# EAGLE design cpNode_V3_4 (EAGLE 7.7.0)
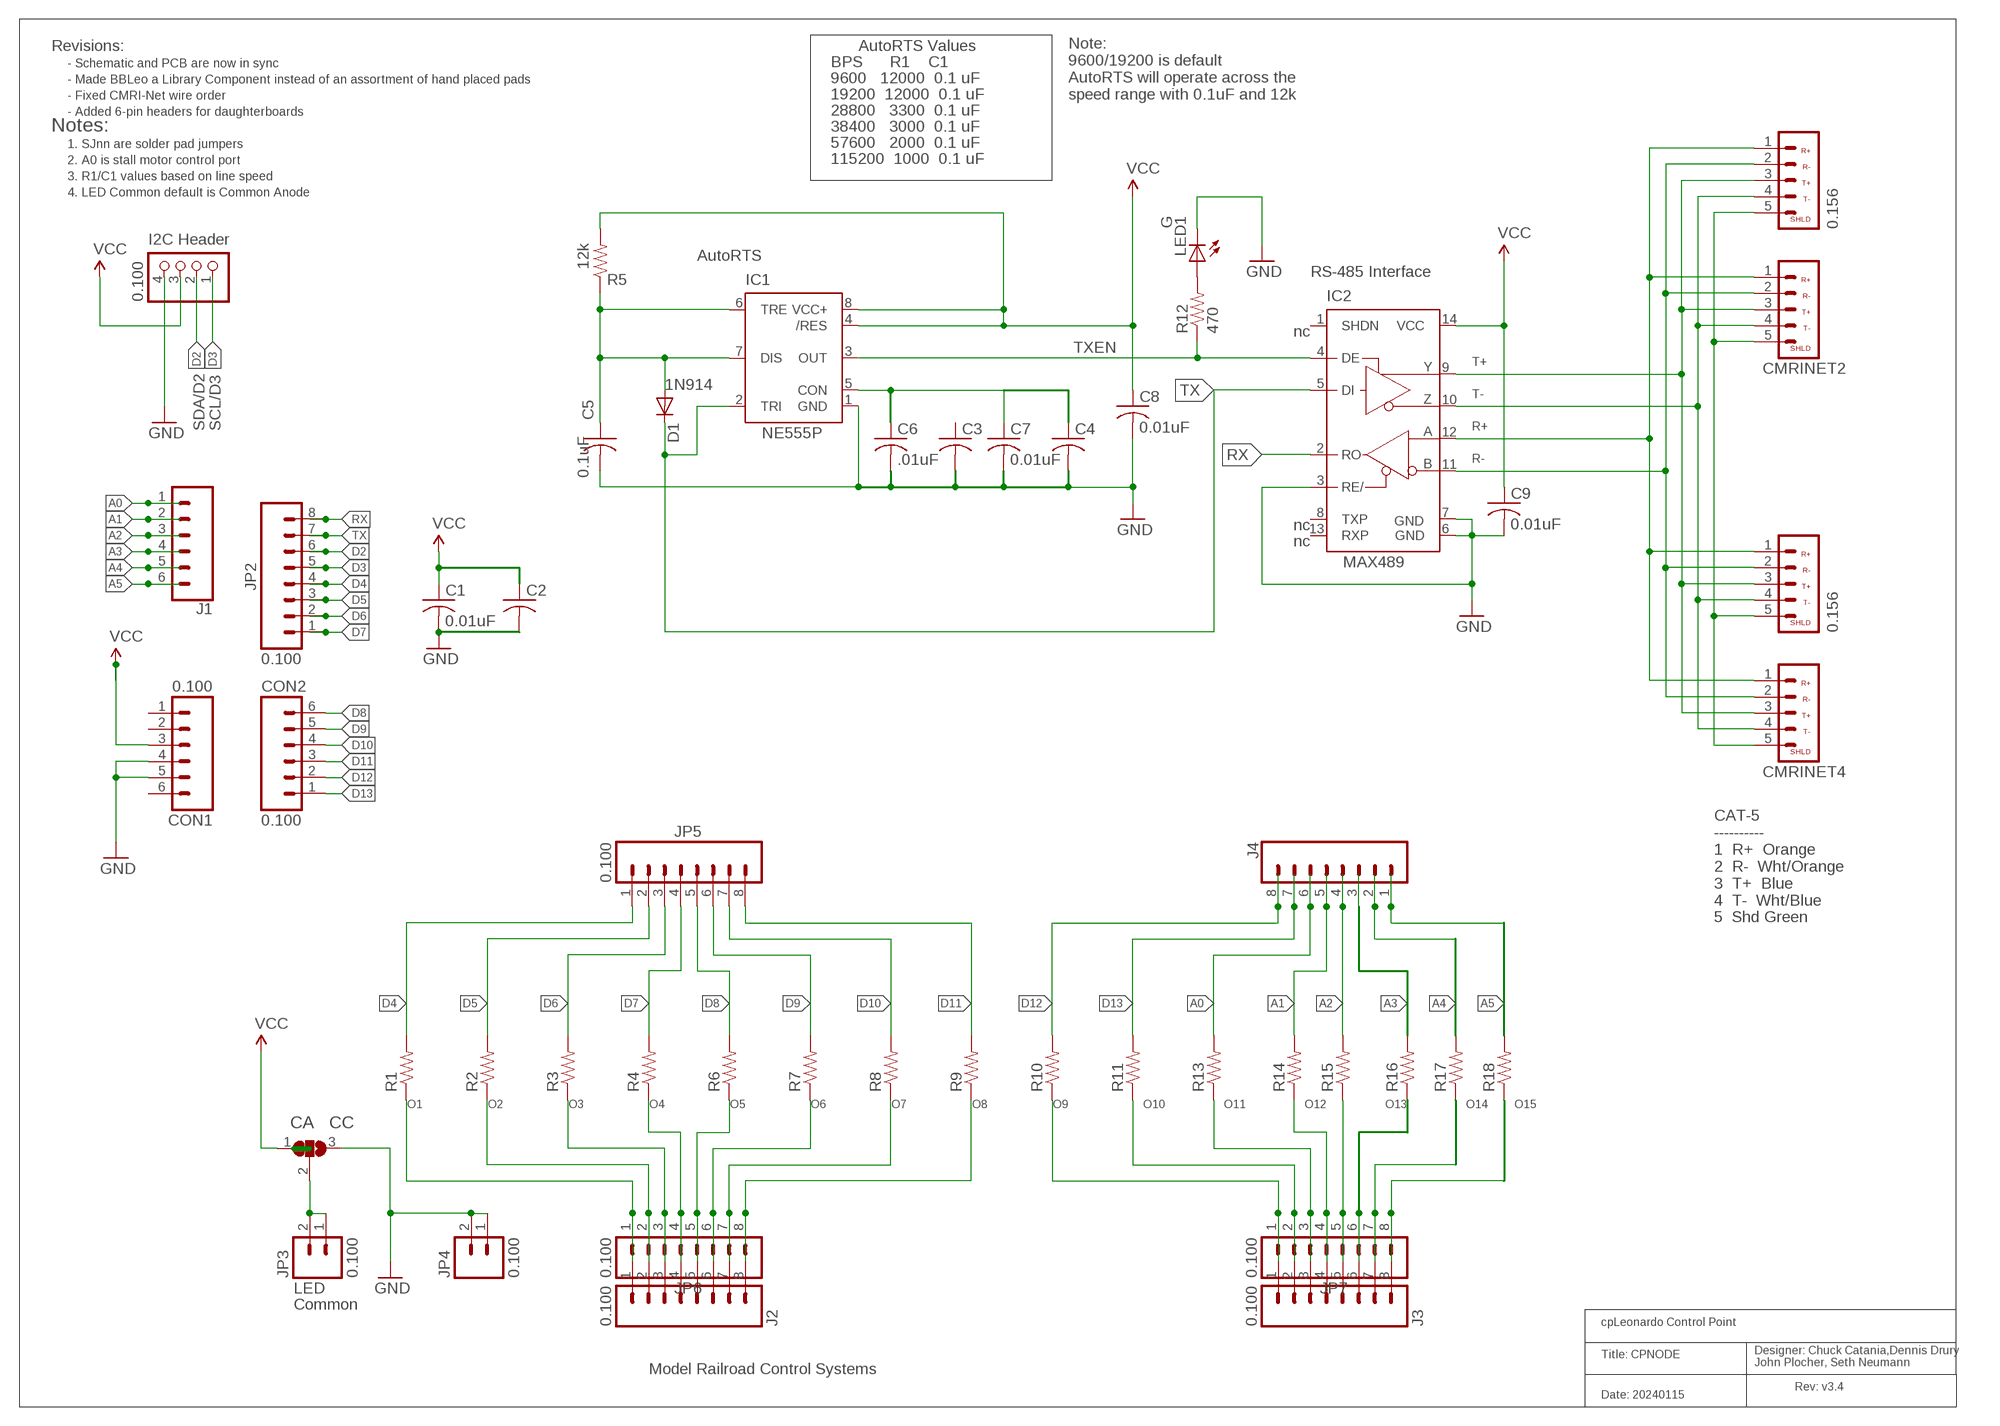
[diagram p0: schematic, sheet 1]

## Parts
C1  0.01uF  CAPPTH2  [C-PTH-0.100]
C2  CAPPTH1  [C050-024X044]
C3  CAPPTH1  [C050-024X044]
C4  CAPPTH1  [C050-024X044]
C5  0.1uF  CAPPTH2  [C-PTH-0.100]
C6  .01uF  CAPPTH1  [C050-024X044]
C7  0.01uF  CAPPTH2  [C-PTH-0.100]
C8  0.01uF  CAPPTH2  [C-PTH-0.100]
C9  0.01uF  CAPPTH2  [C-PTH-0.100]
CMRINET1  0.156  CONNECTOR-CMRINET.156  [KK-156-5]
CMRINET2  3.5mm  CONNECTOR-CMRINET3.5MM  [CMRINET-3.5MM]
CMRINET3  0.156  CONNECTOR-CMRINET.156  [KK-156-5]
CMRINET4  3.5mm  CONNECTOR-CMRINET3.5MM  [CMRINET-3.5MM]
CON1  0.100  CONNECTOR-M06SIP_LOCK  [1X06-SIP_LOCK]
CON2  0.100  CONNECTOR-M06SIP_LOCK  [1X06-SIP_LOCK]
D1  1N4148  DIODE1N4148  [DIODE-1N4148]
IC1  NE555P  [DIL-08]
IC2  MAX3465CPD  [DIL14]
J1  CONN_06SILK_FEMALE_PTH  [1X06]
J2  0.100  CONNECTOR-M08LOCK_LONGPADS  [1X08_LOCK_LONGPADS]
J3  0.100  CONNECTOR-M08LOCK_LONGPADS  [1X08_LOCK_LONGPADS]
J4  CONN_08"  [1X08]
JP1  0.100  PINHD-1X4/90  [1X04/90]
JP2  0.100  M081X08  [1X08]
JP3  0.100  M02POLAR_LOCK  [MOLEX-1X2_LOCK]
JP4  0.100  M02POLAR_LOCK  [MOLEX-1X2_LOCK]
JP5  0.100  M081X08  [1X08]
JP6  0.100  M081X08  [1X08]
JP7  0.100  M081X08  [1X08]
LED1  G  LEDLED3MM  [LED3MM]
P1  CA CC  PAD-SOLDERJUMPER-2WAYT  [3P-SMD-2X4.8]
R1  RPTH-R0  [CUT-R]
R2  RPTH-R0  [CUT-R]
R3  RPTH-R0  [CUT-R]
R4  RPTH-R0  [CUT-R]
R5  12k  RPTH04  [AXIAL-0.4-RES]
R6  RPTH-R0  [CUT-R]
R7  RPTH-R0  [CUT-R]
R8  RPTH-R0  [CUT-R]
R9  RPTH-R0  [CUT-R]
R10  RPTH-R0  [CUT-R]
R11  RPTH-R0  [CUT-R]
R12  470  RPTH04  [AXIAL-0.4-RES]
R13  RPTH-R0  [CUT-R]
R14  RPTH-R0  [CUT-R]
R15  RPTH-R0  [CUT-R]
R16  RPTH-R0  [CUT-R]
R17  RPTH-R0  [CUT-R]
R18  RPTH-R0  [CUT-R]

## Nets
A0: J1.1 J4.6 R13.P1
A1: J1.2 J4.5 R14.P1
A2: J1.3 J4.4 R15.P1
A3: J1.4 J4.3 R16.P1
A4: J1.5 J4.2 R17.P1
A5: J1.6 J4.1 R18.P1
D2: JP1.2 JP2.6
D3: JP1.1 JP2.5
D4: JP2.4 JP5.1 R1.P1
D5: JP2.3 JP5.2 R2.P1
D6: JP2.2 JP5.3 R3.P1
D7: JP2.1 JP5.4 R4.P1
D8: CON2.6 JP5.5 R6.P1
D9: CON2.5 JP5.6 R7.P1
D10: CON2.4 JP5.7 R8.P1
D11: CON2.3 JP5.8 R9.P1
D12: CON2.2 J4.8 R10.P1
D13: CON2.1 J4.7 R11.P1
GND: C1.2 C2.2 C3.2 C4.2 C5.2 C6.2 C7.2 C8.2 C9.2 CON1.4 CON1.5 IC1.1(GND) IC2.3(RE/) IC2.6(GND) IC2.7(GND) JP1.4 JP4.1 JP4.2 LED1.K(C) P1.3
N$29: LED1.A R12.P$2
N$38: C4.1 C6.1 C7.1 IC1.5(CON)
N$45: JP3.1 JP3.2 P1.2
N$52: C5.1 D1.A IC1.6(TRE) IC1.7(DIS) R5.P$1
N$54: IC1.3(OUT) IC2.4(DE) R12.P$1
O1: J2.1 JP6.1 R1.P2
O2: J2.2 JP6.2 R2.P2
O3: J2.3 JP6.3 R3.P2
O4: J2.4 JP6.4 R4.P2
O5: J2.5 JP6.5 R6.P2
O6: J2.6 JP6.6 R7.P2
O7: J2.7 JP6.7 R8.P2
O8: J2.8 JP6.8 R9.P2
O9: J3.1 JP7.1 R10.P2
O10: J3.2 JP7.2 R11.P2
O11: J3.3 JP7.3 R13.P2
O12: J3.4 JP7.4 R14.P2
O13: J3.5 JP7.5 R15.P2
O14: J3.6 JP7.6 R16.P2
O15: J3.7 JP7.7 R17.P2
O16: J3.8 JP7.8 R18.P2
R+: CMRINET1.1 CMRINET2.1 CMRINET3.1 CMRINET4.1 IC2.12(A)
R-: CMRINET1.2 CMRINET2.2 CMRINET3.2 CMRINET4.2 IC2.11(B)
RX: IC2.2(RO) JP2.8
SHIELD: CMRINET1.5 CMRINET2.5 CMRINET3.5 CMRINET4.5
T+: CMRINET1.3 CMRINET2.3 CMRINET3.3 CMRINET4.3 IC2.9(Y)
T-: CMRINET1.4 CMRINET2.4 CMRINET3.4 CMRINET4.4 IC2.10(Z)
TX: D1.C IC1.2(TRI) IC2.5(DI) JP2.7
VCC: C1.1 C2.1 C8.1 C9.1 CON1.3 IC1.4(/RES) IC1.8(VCC+) IC2.14(VCC) JP1.3 P1.1 R5.P$2
Unconnected: C3.1 CON1.1 CON1.2 CON1.6 IC2.1(SHDN) IC2.8(TXP) IC2.13(RXP)

## Notes on the sheet
- Revisions: | AutoRTS Values
- - Schematic and PCB are now in sync | BPS      R1    C1
- - Made BBLeo a Library Component instead of an assortment of hand placed pads | 9600   12000  0.1 uF
- - Fixed CMRI-Net wire order | 19200  12000  0.1 uF
- Note: 
  9600/19200 is default
  AutoRTS will operate across the
  speed range with 0.1uF and 12k
- - Added 6-pin headers for daughterboards | 28800   3300  0.1 uF
- Notes: | 38400   3000  0.1 uF
- 1. SJnn are solder pad jumpers | 57600   2000  0.1 uF
- 2. A0 is stall motor control port | 115200  1000  0.1 uF
- 3. R1/C1 values based on line speed
- 4. LED Common default is Common Anode
- I2C Header
- AutoRTS
- RS-485 Interface
- nc
- TXEN
- T+
- 1N914
- T-
- SDA/D2 | SCL/D3 | R+
- R-
- nc
- nc
- MAX489
- CAT-5
  ----------
  1  R+  Orange
  2  R-  Wht/Orange
  3  T+  Blue
  4  T-  Wht/Blue
  5  Shd Green
- LED
- Common
- cpLeonardo Control Point
- Title: CPNODE
- Designer: Chuck Catania,Dennis Drury
  John Plocher, Seth Neumann
- Model Railroad Control Systems
- Rev: v3.4
- Date: 20240115

## Library data of the parts
C1-C9 = SPCoast:CAP*
CMRINET1-CMRINET4 = SPCoast:CONNECTOR-CMRINET: CMRINet Top 3.5mm Screw Terminal 5 pos
CON1 CON2 = SPCoast:CONNECTOR-M06: Header 6 Standard 6-pin 0.1" header
D1 = SPCoast:DIODE: Diode These are standard reverse protection diodes and small signal diodes. SMA package can handle up to about 1A. SOD-323 can handle about 200mA. What the SOD-323 package when ordering, there are some mfgs out there that are 5-pin packages.
IC1 = SparkFun:NE555: General purpose bipolar Timer; MF: Arrow Electronics; MPN: NE555N; OC_FARNELL: 1467742; OC_NEWARK: 89K1486
IC2 = maxim:MAX346*: +5V, Fail-Safe, 40Mbps, Profibus RS-485/RS-422 Transceivers Source: MAX3465-MAX3469.pdf; MPN: MAX3465CPD+; OC_FARNELL: unknown; OC_NEWARK: 42M5444
J1 = SparkFun-Connectors:CONN_06: Multi connection point. Often used as Generic Header-pin footprint for 0.1 inch spaced/style header connections On any of the 0.1 inch spaced packages, you can populate with these: Break Away Headers - Straight <https://www.sparkfun.com/products/116> (PRT-00116) Break Away Male Headers - Right Angle <https://www.sparkfun.com/products/553> (PRT-00553) Female Headers <https://www.sparkfun.com/products/115> (PRT-00115) Break Away Headers - Machine Pin <https://www.sparkfun.com/products/117> (PRT-00117) Break Away Female Headers - Swiss Machine Pin <https://www.sparkfun.com/products/743> (PRT-00743) Arduino Stackable Header - 6 Pin <https://www.sparkfun.com/products/9280> (PRT-09280) For SCREWTERMINALS and SPRING TERMINALS visit here: Screw Terimnals on SparkFun.com <https://www.sparkfun.com/search/results?term=Screw+Terminals> (5mm/3.5mm/2.54mm spacing) This device is also useful as a general connection point to wire up your design to another part of your project. Our various solder wires solder well into these plated through hole pads. Hook-Up Wire - Assortment (Stranded, 22 AWG) <https://www.sparkfun.com/products/11375> (PRT-11375) Hook-Up Wire - Assortment (Solid Core, 22 AWG) <https://www.sparkfun.com/products/11367> (PRT-11367) View the entire wire category on our website here <https://www.sparkfun.com/categories/141>; PROD_ID: CONN-08437
J2 J3 = SPCoast:CONNECTOR-M08: Header 8 Standard 8-pin 0.1" header. Use with straight break away headers (SKU : PRT-00116), right angle break away headers (PRT-00553), swiss pins (PRT-00743), machine pins (PRT-00117), and female headers (PRT-00115).
J4 = SparkFun-Connectors:CONN_08: Multi connection point. Often used as Generic Header-pin footprint for 0.1 inch spaced/style header connections On any of the 0.1 inch spaced packages, you can populate with these: Break Away Headers - Straight <https://www.sparkfun.com/products/116> (PRT-00116) Break Away Male Headers - Right Angle <https://www.sparkfun.com/products/553> (PRT-00553) Female Headers <https://www.sparkfun.com/products/115> (PRT-00115) Break Away Headers - Machine Pin <https://www.sparkfun.com/products/117> (PRT-00117) Break Away Female Headers - Swiss Machine Pin <https://www.sparkfun.com/products/743> (PRT-00743) Arduino Stackable Header - 8 Pin <https://www.sparkfun.com/products/9279> (PRT-09279) For SCREWTERMINALS and SPRING TERMINALS visit here: Screw Terimnals on SparkFun.com <https://www.sparkfun.com/search/results?term=Screw+Terminals> (5mm/3.5mm/2.54mm spacing) This device is also useful as a general connection point to wire up your design to another part of your project. Our various solder wires solder well into these plated through hole pads. Hook-Up Wire - Assortment (Stranded, 22 AWG) <https://www.sparkfun.com/products/11375> (PRT-11375) Hook-Up Wire - Assortment (Solid Core, 22 AWG) <https://www.sparkfun.com/products/11367> (PRT-11367) View the entire wire category on our website here <https://www.sparkfun.com/categories/141> Special notes: Molex polarized connector foot print use with SKU : PRT-08231 with associated crimp pins and housings. 1MM SMD Version SKU: PRT-10208 NOTES ON THE VARIANTS LOCK and LOCK_LONGPADS... This footprint was designed to help hold the alignment of a through-hole component (i.e. 6-pin header) while soldering it into place. You may notice that each hole has been shifted either up or down by 0.005 of an inch from it's more standard position (which is a perfectly straight line). This slight alteration caused the pins (the squares in the middle) to touch the edges of the holes. Because they are alternating, it causes a "brace" to hold the component in place. 0.005 has proven to be the perfect amount of "off-center" position when using our standard breakaway headers. Although looks a little odd when you look at the bare footprint, once you have a header in there, the alteration is very hard to notice. Also,if you push a header all the way into place, it is covered up entirely on the bottom side.; PROD_ID: CONN-08438
JP1 = pinhead:PINHD-1X4: PIN HEADER
JP2 JP5-JP7 = SparkFun:M08: Header 8 Standard 8-pin 0.1" header. Use with straight break away headers (SKU : PRT-00116), right angle break away headers (PRT-00553), swiss pins (PRT-00743), machine pins (PRT-00117), and female headers (PRT-00115).
JP3 JP4 = SparkFun:M02: Header 2 Standard 2-pin 0.1" header. Use with straight break away headers (SKU : PRT-00116), right angle break away headers (PRT-00553), swiss pins (PRT-00743), machine pins (PRT-00117), and female headers (PRT-00115). Molex polarized connector foot print use with SKU : PRT-08233 with associated crimp pins and housings.
LED1 = SPCoast:LED*
P1 = Discreter:PAD-SOLDERJUMPER-2WAY: Solder Jumper 2 way solder jumper
R1-R18 = SPCoast:R*: Resistor Basic schematic elements and footprints for 0603, 1206, and PTH 1/10th watt (small) resistors.

## Board
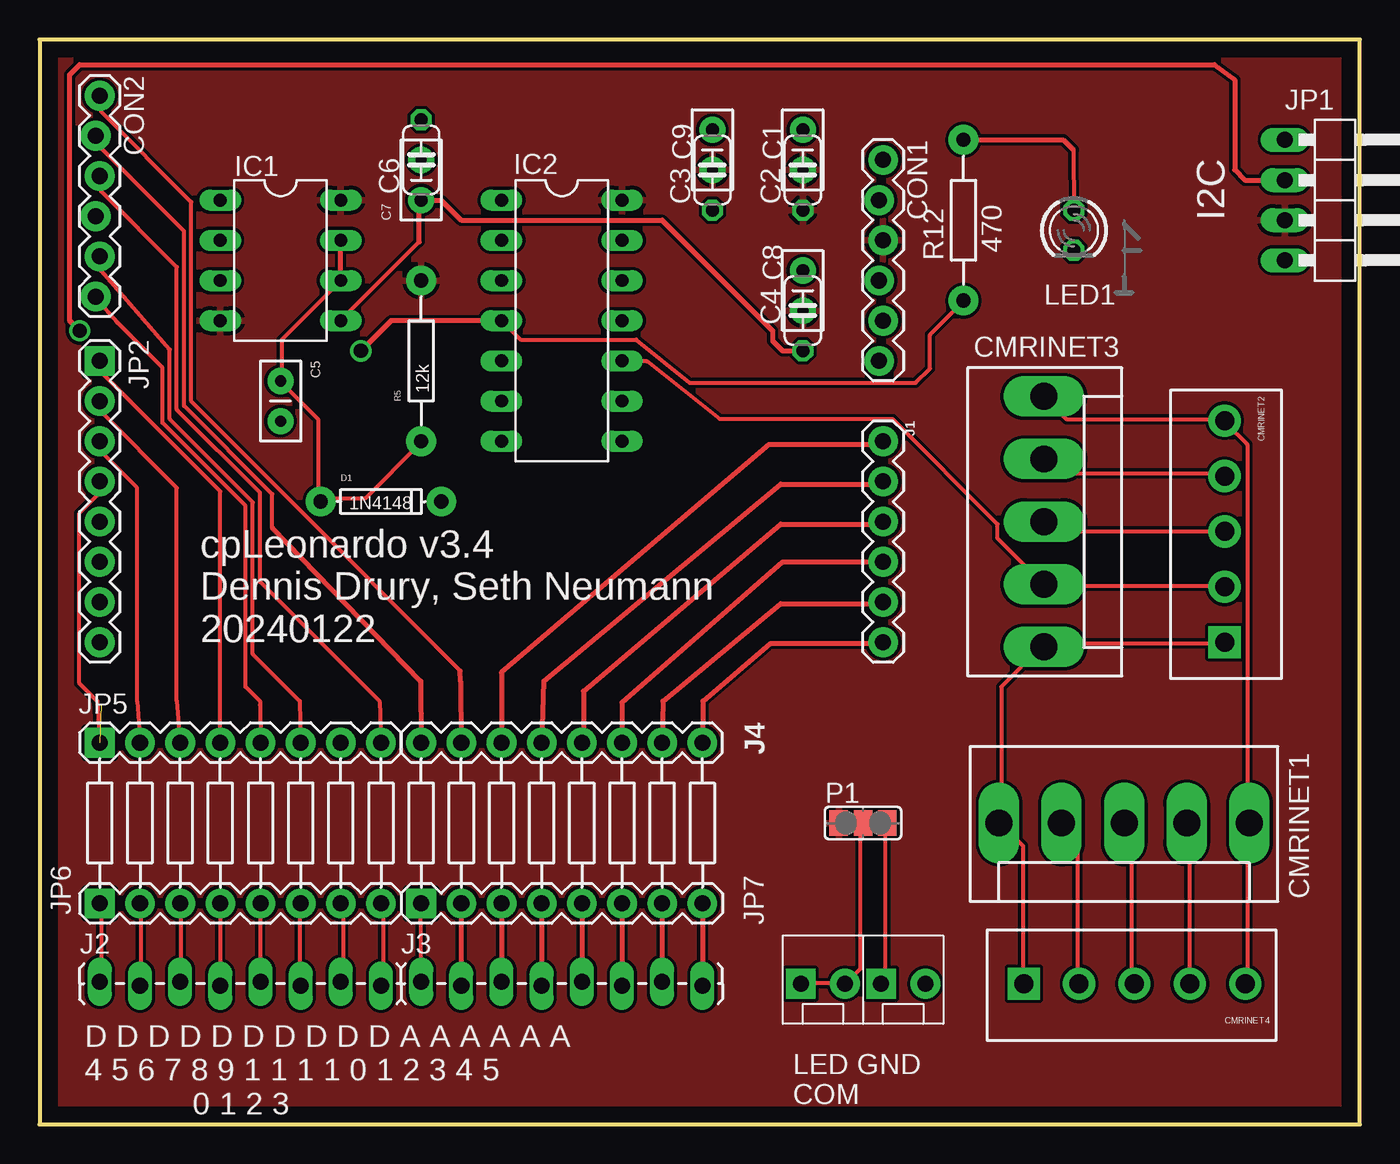
[diagram p1: board, top side]
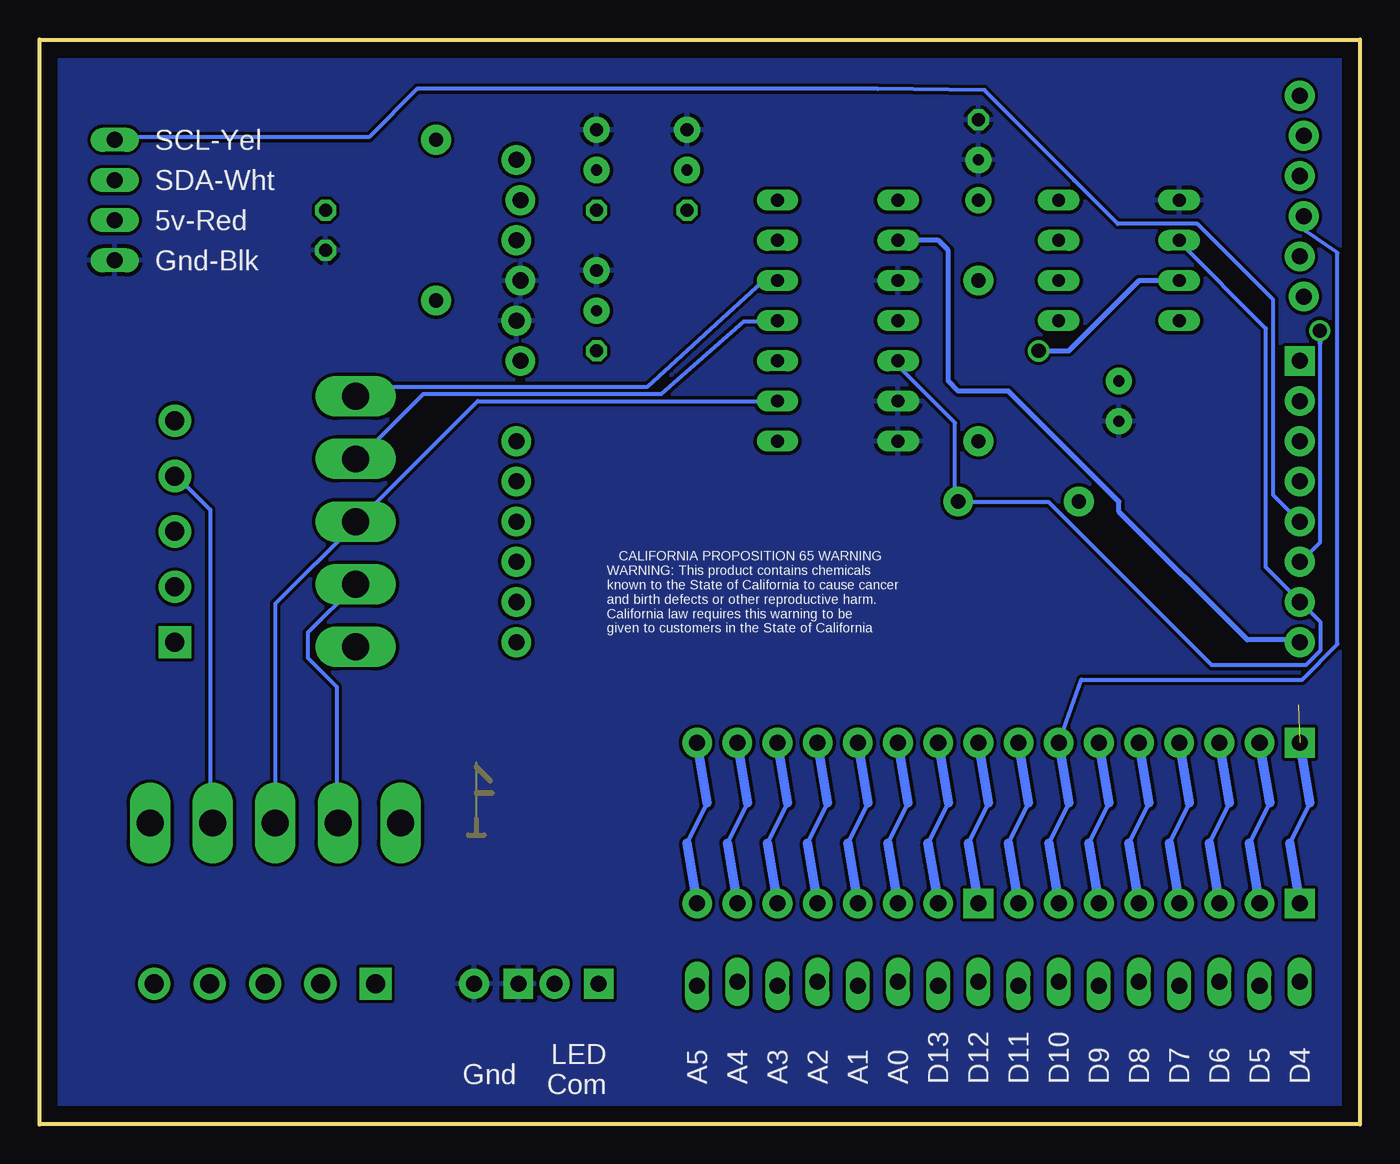
[diagram p2: board, bottom side, seen from below]

Size 83.49 x 68.57 mm. Coordinates in mm from the lower left corner, seen from the top.
Outline: 0,0 83.49,0 83.49,68.57 0,68.57 0,0
Copper layers (1*16): Top 0.035mm / dielectric 1.5mm / Bottom 0.035mm
Design rules "default": minimum track width 10mil, minimum drill 24mil, track to track 8mil, track to pad 8mil, pad to pad 8mil, via to via 8mil, smd to smd 8mil, copper to edge 40mil, drill to drill 8mil, minimum pad ring 10mil, minimum via ring 8mil, stop-mask expansion 4mil, vias tented up to drill 0mil, thermal gap 10mil

### Footprints (pad centres in the part's own frame; a part is rotated, then mirrored left to right if it is on the bottom)
C-PTH-0.100 = drill 0.7 pad 1.651: 1 -1.27,0; 2 1.27,0
C050-024X044 = drill 0.813 octagon: 1 -2.54,0; 2 2.54,0
KK-156-5 = drill 1.7 pad 2.184 long: 1 -7.92,0; 2 -3.96,0; 3 0,0; 4 3.96,0; 5 7.92,0
CMRINET-3.5MM = drill 1.2 pad 2.032: 1 -6.38,0; 2 -2.88,0; 3 0.62,0; 4 4.12,0 | drill 1.2 pad 2.032 square: 5 7.62,0
1X06-SIP_LOCK = drill 1.016 pad 1.88: 1 0,0; 2 2.54,-0.254; 3 5.08,0; 4 7.62,-0.254; 5 10.16,0; 6 12.7,-0.254
DIODE-1N4148 = drill 0.9 pad 1.88: A 3.81,0; C -3.81,0
DIL-08 = drill 0.813 long: 1 -3.81,-3.81; 2 -1.27,-3.81; 3 1.27,-3.81; 4 3.81,-3.81; 5 3.81,3.81; 6 1.27,3.81; 7 -1.27,3.81; 8 -3.81,3.81
DIL14 = drill 0.813 long: 1 -7.62,-3.81; 2 -5.08,-3.81; 3 -2.54,-3.81; 4 0,-3.81; 5 2.54,-3.81; 6 5.08,-3.81; 7 7.62,-3.81; 8 7.62,3.81; 9 5.08,3.81; 10 2.54,3.81; 11 0,3.81; 12 -2.54,3.81; 13 -5.08,3.81; 14 -7.62,3.81
1X06 = drill 1.016 pad 1.88: 1 0,0; 2 2.54,0; 3 5.08,0; 4 7.62,0; 5 10.16,0; 6 12.7,0
1X08_LOCK_LONGPADS = drill 1.016 long: 1 0,0.127; 2 2.54,-0.127; 3 5.08,0.127; 4 7.62,-0.127; 5 10.16,0.127; 6 12.7,-0.127; 7 15.24,0.127; 8 17.78,-0.127
1X08 = drill 1.016 pad 1.88: 1 0,0; 2 2.54,0; 3 5.08,0; 4 7.62,0; 5 10.16,0; 6 12.7,0; 7 15.24,0; 8 17.78,0
1X04/90 = drill 1.016 long: 1 -3.81,-3.81; 2 -1.27,-3.81; 3 1.27,-3.81; 4 3.81,-3.81
1X08' = drill 1.016 pad 1.88 square: 1 0,0 | drill 1.016 pad 1.88: 2 2.54,0; 3 5.08,0; 4 7.62,0; 5 10.16,0; 6 12.7,0; 7 15.24,0; 8 17.78,0
MOLEX-1X2_LOCK = drill 1.016 pad 1.88 square: 1 -0.127,0 | drill 1.016 pad 1.88: 2 2.667,0
LED3MM = drill 0.813 octagon: A 1.27,0; K -1.27,0
3P-SMD-2X4.8 = smd 1.168 x 1.6: 1 -1.524,0; 2 0,0; 3 1.524,0
CUT-R = drill 0.9 pad 1.88: P1 5.08,0; P2 -5.08,0
AXIAL-0.4-RES = drill 0.9 pad 1.88: P$1 -5.08,0; P$2 5.08,0

### Placement (x,y rotation side)
C1  48.26,61.59 90 top
C2  48.26,60.33 90 top
C3  42.55,60.33 90 top
C4  48.26,51.44 90 top
C5  15.24,45.72 270 top
C6  24.13,60.96 90 top
C7  24.13,59.69 90 top
C8  48.26,52.7 90 top
C9  42.55,61.59 90 top
CMRINET1  68.58,19.05 180 top
CMRINET2  74.93,38.1 270 top
CMRINET3  63.5,38.1 270 top
CMRINET4  69.85,8.89 180 top
CON1  53.34,60.96 270 top
CON2  3.81,65.02 270 top
D1  21.59,39.37 180 top
IC1  15.24,54.61 270 top
IC2  33.02,50.8 270 top
J1  53.34,43.18 270 top
J2  3.81,8.89 0 top
J3  24.13,8.89 0 top
J4  41.91,24.13 180 top
JP1  82.55,58.42 270 top
JP2  0.100  [1X08']  3.81,48.26 270 top
JP3  48.26,8.89 0 top
JP4  53.34,8.89 0 top
JP5  0.100  [1X08']  3.81,24.13 0 top
JP6  0.100  [1X08']  3.81,13.97 0 top
JP7  0.100  [1X08']  24.13,13.97 0 top
LED1  65.41,56.52 90 top
P1  52.07,19.05 0 top
R1  3.81,19.05 90 top
R2  6.35,19.05 90 top
R3  8.89,19.05 90 top
R4  11.43,19.05 90 top
R5  24.13,48.26 90 top
R6  13.97,19.05 90 top
R7  16.51,19.05 90 top
R8  19.05,19.05 90 top
R9  21.59,19.05 90 top
R10  24.13,19.05 90 top
R11  26.67,19.05 90 top
R12  58.42,57.15 90 top
R13  29.21,19.05 90 top
R14  31.75,19.05 90 top
R15  34.29,19.05 90 top
R16  36.83,19.05 90 top
R17  39.37,19.05 90 top
R18  41.91,19.05 90 top
U$1  [CA-PROP65WARNING]  41.27,33.66 0 bottom
U$2  [MRCSLOGOBTM]  49.53,17.78 0 top
U$3  [MRCSLOGOTOP]  67.31,52.07 0 top

### Tracks (layer width: path | path; a pad name or v marks a point on that pad's centre or on a via)
A0
  Top 0.254: 53.26,42.98 J1.1
  Top 0.305: 53.26,42.98 46.15,42.98 29.21,28.57 R13.P1
A1
  Top 0.254: 53.26,40.46 J1.2
  Top 0.305: 53.26,40.46 46.86,40.46 31.88,28.02 R14.P1
A2
  Top 0.254: 53.26,37.95 J1.3
  Top 0.305: 53.26,37.95 46.86,37.95 34.39,27.38 34.39,24.23 R15.P1
A3
  Top 0.305: J1.4 46.99,35.56 36.83,26.67 R16.P1
A4
  Top 0.254: 53.26,32.92 J1.5
  Top 0.305: 53.26,32.92 46.86,32.92 39.42,26.75 R17.P1
A5
  Top 0.254: 41.94,23.98 R18.P1 | 53.26,30.4 J1.6
  Top 0.305: 53.26,30.4 46.23,30.4 41.94,26.75 R18.P1
D2  (via drill 0.9)
  Top 0.305: v2.54,50.16 1.91,50.8 1.91,66.36 2.54,66.99 74.3,66.99 75.56,66.04 75.56,60.33 76.2,59.69 JP1.2
  Bottom 0.254: 2.52,49.38 2.52,36.8 3.66,35.66 JP2.6 | 78.87,59.89 JP1.2
  Bottom 0.305: 2.52,49.38 2.52,49.51 v2.54,50.16
D3
  Bottom 0.254: JP2.5 5.49,39.78 5.49,52.12 10.29,56.92 15.32,56.92 18.06,59.66 23.74,65.38 30.48,65.46 59.61,65.46 62.66,62.41 78.64,62.41 JP1.1
D4  (1 unrouted)
  Top 0.254: JP2.4 3.66,40.46 3.66,39.78 2.52,38.63 2.52,27.89 3.66,26.75 R1.P1
D5
  Top 0.254: JP2.3 3.89,42.98 3.89,42.52 6.17,40.23 6.17,26.75 R2.P1
D6
  Top 0.254: JP2.2 3.89,45.72 3.89,45.03 8.69,40.23 8.69,26.75 R3.P1
D7
  Top 0.254: R4.P1 11.43,40.01 3.89,47.55 3.89,48.23 JP2.1
D8
  Top 0.254: 13.95,26.52 R6.P1 13.95,26.75 13.03,27.66 13.03,39.09 7.77,44.35 7.77,47.82 4.93,50.66 3.66,52.12 CON2.6
D9
  Top 0.254: CON2.5 3.89,54.86 3.89,53.95 8.23,48.97 8.23,44.58 13.49,39.32 13.49,29.72 16.46,26.75 R7.P1
D10
  Bottom 0.254: R8.P1 17.6,28.12 3.66,28.12 1.42,30.35 1.42,55.09 3.43,56.46 3.43,57.38 CON2.4
D11
  Top 0.254: CON2.3 3.89,59.89 3.89,58.98 8.69,54.18 8.69,45.19 13.95,39.93 13.95,34.29 21.49,26.75 R9.P1
D12
  Top 0.254: 24.11,23.98 R10.P1 | 14.72,37.72 14.72,39.84 9.14,45.41 9.14,56.46 3.66,61.95 3.66,62.41 CON2.2
  Top 0.305: 14.72,37.72 24.11,28.02 R10.P1
D13
  Top 0.254: 26.61,28.66 15.49,39.8 9.6,45.7 9.6,58.29 3.89,64.01 3.89,64.92 CON2.1
  Top 0.305: 26.61,28.66 26.62,28.02 R11.P1
GND
  Top 0.254: 53.26,53.49 CON1.4 | 53.03,53.49 CON1.4 | 53.26,50.98 CON1.5 | 53.26,53.26 CON1.4 | P1.3 53.49,18.97 53.49,9.14 53.26,8.91 JP4.1 | 56.01,8.91 JP4.2
  Bottom 0.254: 29.26,53.26 IC2.3 29.26,53.49 | 53.03,8.91 JP4.1 | 42.47,62.71 C3.2
  pour Bottom: 0,0 83.82,0 83.82,68.58 0,68.58
N$29
  Top 0.254: 65.37,61.59 LED1.A
  Top 0.305: R12.P$2 64.73,62.23 65.37,61.59
N$38
  Top 0.254: 24,55.78 19.2,50.98 IC1.5
  Top 0.305: 24,55.78 24,58.29 C6.1 25.4,58.42 26.67,57.15 39.37,57.15 46.35,50.16 46.35,49.53 46.99,48.9 C4.1
N$45
  Top 0.254: P1.2 51.89,18.97 51.89,9.83 50.98,8.91 JP3.2 50.75,8.91 48.23,8.91 JP3.1
N$52
  Top 0.254: R5.P$1 24,42.98 20.57,39.55 17.83,39.55 D1.A 17.6,39.55 17.6,44.58 15.32,46.86 C5.1 15.32,47.09 15.32,49.61 IC1.6
  Top 0.305: IC1.6 IC1.7
N$54  (via drill 0.9)
  Top 0.254: IC2.4 30.4,49.61 37.72,49.61 41.1,46.86 55.4,46.86 56.31,47.78 56.31,49.91 58.29,51.89 R12.P$1
  Top 0.305: IC2.4 22.23,50.8 v20.32,48.9
  Bottom 0.305: v20.32,48.9 18.41,48.9 13.97,53.34 IC1.3
O1
  Top 0.254: 3.89,14.17 R1.P2 3.89,13.95 3.89,9.14 J2.1
O2
  Top 0.254: 6.4,14.17 R2.P2 6.4,13.95 6.4,8.91 J2.2
O3
  Top 0.254: 8.91,14.17 R3.P2 8.91,13.95 8.91,9.14 J2.3
O4
  Top 0.254: R4.P2 J2.4
O5
  Top 0.254: 13.95,14.17 R6.P2 13.95,13.95 13.95,9.14 J2.5
O6
  Top 0.254: 16.46,14.17 R7.P2 16.46,13.95 16.46,8.91 J2.6
O7
  Top 0.254: 18.97,14.17 R8.P2 19.2,13.95 19.2,9.14 J2.7
O8
  Top 0.254: 21.49,14.17 R9.P2 21.72,13.95 21.72,8.91 J2.8
O9
  Top 0.254: J3.1 24.11,11.68 24.11,12.68 R10.P2
O10
  Top 0.254: 26.62,8.91 J3.2
  Top 0.305: R11.P2 J3.2
O11
  Top 0.305: R13.P2 J3.3
O12
  Top 0.305: R14.P2 J3.4
O13
  Top 0.305: R15.P2 J3.5
O14
  Top 0.254: 36.91,10.19 J3.6
  Top 0.305: R16.P2 J3.6
O15
  Top 0.305: R17.P2 J3.7
O16
  Top 0.254: 41.94,10.19 J3.8
  Top 0.305: R18.P2 J3.8
R+
  Top 0.254: CMRINET4.1 76.35,8.91 76.35,18.97 CMRINET1.1 76.35,19.2 76.35,42.98 74.98,44.35 CMRINET2.1 74.75,44.58 64.92,44.58 63.55,45.95 CMRINET3.1
  Bottom 0.254: IC2.12 37.03,53.26 37.77,53.26 45.03,46.63 62.87,46.63 63.32,46.18 CMRINET3.1
R-
  Top 0.254: CMRINET4.2 72.69,8.91 72.69,18.97 CMRINET1.2 | CMRINET2.2 74.75,41.15 64.24,41.15 63.55,41.83 CMRINET3.2
  Bottom 0.254: IC2.11 37.03,50.75 38.96,50.75 44.17,46.18 59.21,46.18 63.32,42.06 CMRINET3.2 | CMRINET1.2 72.69,19.2 72.69,38.86 74.75,40.92 CMRINET2.2
RX
  Bottom 0.254: 29.03,55.78 IC2.2 | 3.89,30.63 JP2.8
  Bottom 0.305: 3.89,30.63 7.14,30.63 15.24,38.73 15.24,39.37 22.23,46.35 25.4,46.35 26.04,46.99 26.04,55.24 26.67,55.88 IC2.2
SHIELD
  Top 0.254: CMRINET4.5 62.18,8.91 62.18,17.6 60.81,18.97 CMRINET1.5 60.81,19.2 60.81,27.66 63.32,30.18 CMRINET3.5 63.55,30.4 74.75,30.4 CMRINET2.5
T+
  Top 0.254: CMRINET4.3 69.04,8.91 69.04,18.52 68.58,18.97 CMRINET1.3 | CMRINET2.3 74.75,37.49 64.01,37.49 63.55,37.95 CMRINET3.3
  Bottom 0.254: IC2.9 55.78,45.72 63.32,38.18 CMRINET3.3 63.55,37.95 68.58,32.92 CMRINET1.3
T-
  Top 0.254: CMRINET4.4 65.61,8.91 65.61,18.06 64.69,18.97 CMRINET1.4 | IC2.10 37.03,48.23 38.41,48.23 43.02,44.58 53.95,44.58 60.58,37.95 60.58,37.03 63.32,34.29 CMRINET3.4 63.55,34.06 74.75,34.06 CMRINET2.4
  Bottom 0.254: CMRINET1.4 64.69,19.2 64.69,27.66 66.52,29.49 66.52,31.09 63.55,34.06 CMRINET3.4
TX
  Bottom 0.254: IC2.5 29.03,48.23 29.03,47.78 25.6,44.35 25.6,39.55 D1.C 25.38,39.32 19.66,39.32 9.37,29.03 3.43,29.03 2.52,29.95 2.52,31.77 3.66,32.92 JP2.7 3.89,33.15 5.94,35.2 5.94,50.29 11.43,55.78 IC1.2
VCC
  Bottom 0.254: 53.49,56.01 CON1.3 53.26,55.78 | 48.46,50.98 C8.1
  pour Top: 0,0 83.82,0 83.82,68.58 0,68.58

### Text on the board
tPlace: I2C | cpLeonardo v3.4 / Dennis Drury, Seth Neumann / 20240122 | D D D D D D D D D D A A A A A A / 4 5 6 7 8 9 1 1 1 1 0 1 2 3 4 5 / 0 1 2 3 | LED GND / COM
bPlace: SCL-Yel | SDA-Wht | 5v-Red | Gnd-Blk | LED / Com | Gnd | D4 | D5 | D6 | D7 | D8 | D9 | D10 | D11 | D12 | D13 | A0 | A1 | A2 | A3 | A4 | A5